# Altium project PCB_PlacaSensores.PrjPcb
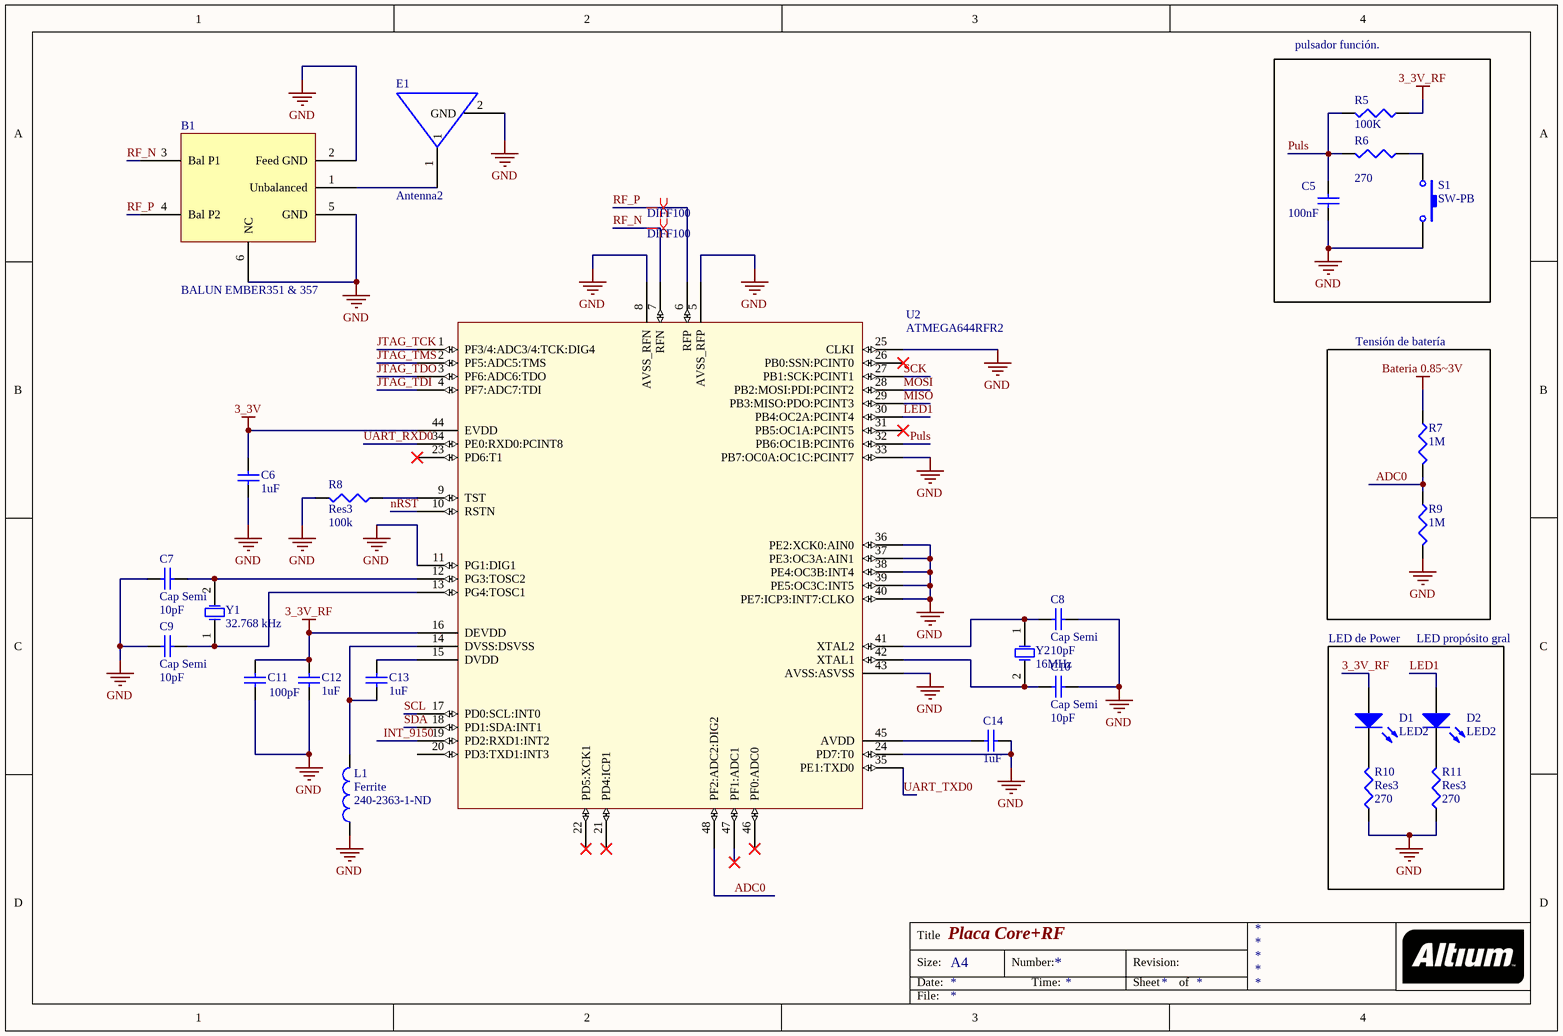
[diagram p0: CoreWB.SchDoc]
3 sheets, 50 parts. Net scope: global (net labels, ports and power ports of the same name join across sheets).
Board files: PCB_Wboard.PcbDoc, PCB1.PcbDoc
Sheets:
  CoreWB.SchDoc
  PowerWB2.SchDoc
  ConnWB.SchDoc

## Sheet CoreWB.SchDoc: Placa Core+RF
size A4; Author: Grupo 5 - Proyecto Final; DrawnBy: Bruno Valinoti; ProjectName: Controlador de luces MIDI

### Parts
(Parts that share a designator on the sheet are numbered #1, #2 ... from top to bottom, then left to right.)
B1  BALUN EMBER351 & 357  [Balun]
C5  value 100nF  [C1206]  (hidden comment: Cap Semi)
C6  value 1uF  [C1206]  (hidden comment: Cap Semi)
C7  Cap Semi  value 10pF  [1608[0603]]
C8  Cap Semi  value 10pF  [1608[0603]]
C9  Cap Semi  value 10pF  [1608[0603]]
C10  Cap Semi  value 10pF  [1608[0603]]
C11  value 100pF  [1608[0603]]  (hidden comment: Cap Semi)
C12  value 1uF  [C1206]  (hidden comment: Cap Semi)
C13  value 1uF  [C1206]  (hidden comment: Cap Semi)
C14  value 1uF  [C1206]  (hidden comment: Cap Semi)
D1  LED2  [3.2X1.6X1.1]
D2  LED2  [3.2X1.6X1.1]
E1  Antenna2  [ANTENNA]
L1  Ferrite  value 240-2363-1-ND  [0402-A]
R5  value 100K  [6-0805_M]  (hidden comment: Res3)
R6  value 270  [6-0805_M]  (hidden comment: Res3)
R7  value 1M  [6-0805_M]  (hidden comment: Res3)
R8  Res3  value 100k  [J1-0603]
R9  value 1M  [6-0805_M]  (hidden comment: Res3)
R10  Res3  value 270  [J1-0603]
R11#1  Res3  value 270  [J1-0603]
S1  SW-PB  [DPST-4]
U2  ATMEGA644RFR2  [Quad48]
Y1  32.768 kHz  [R38]
Y2  16MHz  [XTAL]

### Blocks framed on the sheet
pulsador función.: C5 R5 R6 S1

### Nets
3_3V: C6.1 U2.44(EVDD)
3_3V_RF: C11.2 C12.1 D1.1(A) R5.1 U2.16(DEVDD)
Bateria 0.85~3V: R7.1
GND: B1.2(Feed_GND) B1.5(GND) B1.6(NC) C5.2 C6.2 C7.1 C8.1 C9.1 C10.1 C11.1 C12.2 C14.2 E1.2(GND) L1.1 R8.2 R9.2 R10.1 R11#1.1 S1.2 U2.5(AVSS_RFP) U2.8(AVSS_RFN) U2.11(PG1:DIG1) U2.24(PD7:T0) U2.25(CLKI) U2.33(PB7:OC0A:OC1C:PCINT7) U2.36(PE2:XCK0:AIN0) U2.37(PE3:OC3A:AIN1) U2.38(PE4:OC3B:INT4) U2.39(PE5:OC3C:INT5) U2.40(PE7:ICP3:INT7:CLKO) U2.43(AVSS:ASVSS)
ADC0: R7.2 R9.1 U2.48(PF2:ADC2:DIG2)
INT_9150: U2.19(PD2:RXD1:INT2)
JTAG_TCK: U2.1(PF3/4:ADC3/4:TCK:DIG4)
JTAG_TDI: U2.4(PF7:ADC7:TDI)
JTAG_TDO: U2.3(PF6:ADC6:TDO)
JTAG_TMS: U2.2(PF5:ADC5:TMS)
LED1: D2.1(A) U2.30(PB4:OC2A:PCINT4)
MISO: U2.29(PB3:MISO:PDO:PCINT3)
MOSI: U2.28(PB2:MOSI:PDI:PCINT2)
nRST: U2.10(RSTN)
Puls: C5.1 R5.2 R6.2 U2.32(PB6:OC1B:PCINT6)
RF_N: B1.3(Bal_P1) U2.7(RFN)
RF_P: B1.4(Bal_P2) U2.6(RFP)
SCK: U2.27(PB1:SCK:PCINT1)
SCL: U2.17(PD0:SCL:INT0)
SDA: U2.18(PD1:SDA:INT1)
UART_RXD0: U2.34(PE0:RXD0:PCINT8)
UART_TXD0: U2.35(PE1:TXD0)
NetB1_1: B1.1(Unbalanced) E1.1
NetC7_2: C7.2 U2.12(PG3:TOSC2) Y1.2(OSC2)
NetC8_2: C8.2 U2.41(XTAL2) Y2.1(OSC1)
NetC9_2: C9.2 U2.13(PG4:TOSC1) Y1.1(OSC1)
NetC10_2: C10.2 U2.42(XTAL1) Y2.2(OSC2)
NetC13_1: C13.1 U2.15(DVDD)
NetC13_2: C13.2 L1.2 U2.14(DVSS:DSVSS)
NetC14_1: C14.1 U2.45(AVDD)
NetD1_2: D1.2(K) R10.2
NetD2_2: D2.2(K) R11#1.2
NetR6_1: R6.1 S1.1
NetR8_1: R8.1 U2.9(TST)

Not connected (* = marked no-connect by the designer): U2 20(PD3:TXD1:INT3) 21(PD4:ICP1)* 22(PD5:XCK1)* 23(PD6:T1)* 26(PB0:SSN:PCINT0)* 31(PB5:OC1A:PCINT5)* 46(PF0:ADC0)* 47(PF1:ADC1)*

### Layout directives
differential pair; class: DIFF100: RF_N, RF_P

### Notes on the sheet
- Tensión de batería
- LED de Power
- LED propósito gral
- Title
- Size:
- Date:
- A4
- Number:
- Time:
- Revision:
- Sheet
- of
- File:

### Library data of the parts
C5-C14 = Cap Semi: Capacitor (Semiconductor SIM Model); Published: 8-Jun-2000; LatestRevisionDate: 29-May-2009; LatestRevisionNote: IPC-7351 Footprint Added.; PackageReference: C1206; Publisher: Altium Limited; PackageDescription: Chip Capacitor
D1 D2 = LED2: Typical RED, GREEN, YELLOW, AMBER GaAs LED; Published: 8-Jun-2000; LatestRevisionDate: 17-Jul-2002; LatestRevisionNote: Re-released for DXP Platform.; PackageVersion: Feb-2002; PackageReference: 3.2X1.6X1.1; Publisher: Altium Limited; PackageDescription: SM LED; 2 Flat Leads
E1 = AntennaF: Antenna 2.4GHz
L1 = Inductor: Code_IEC: 1005; Published: 8-Jun-2000; LatestRevisionDate: 29-May-2009; LatestRevisionNote: IPC-7351 Footprint Added.; PackageReference: 0402-A; Publisher: Altium Limited; PackageDescription: Chip Inductor; Code_JEITA: 0402
R5-R10 R11#1 = Res3: Resistor; Published: 8-Jun-2000; LatestRevisionDate: 29-May-2009; LatestRevisionNote: IPC-7351 Footprint Added.; PackageReference: J1-0603; Publisher: Altium Limited; PackageDescription: Chip Resistor
S1 = SW-PB: Switch; Published: 24-Mar-1999; LatestRevisionDate: 17-Jul-2002; LatestRevisionNote: Re-released for DXP Platform.; PackageReference: SPST-2; Publisher: Altium Limited; PackageDescription: Switch; 2 Leads
Y1 Y2 = XTAL: Crystal Oscillator; Published: 8-Jun-2000; LatestRevisionDate: 17-Jul-2002; LatestRevisionNote: Re-released for DXP Platform.; PackageReference: R38; Publisher: Altium Limited; PackageDescription: Crystal, Thru-Hole; 2 Leads; Body 3.1 x 8.2 mm (Dia.xH)

## Sheet PowerWB2.SchDoc: Fuente de alimentación
size A4; Author: Grupo 5; DrawnBy: Bruno Valinoti; SheetNumber: 1
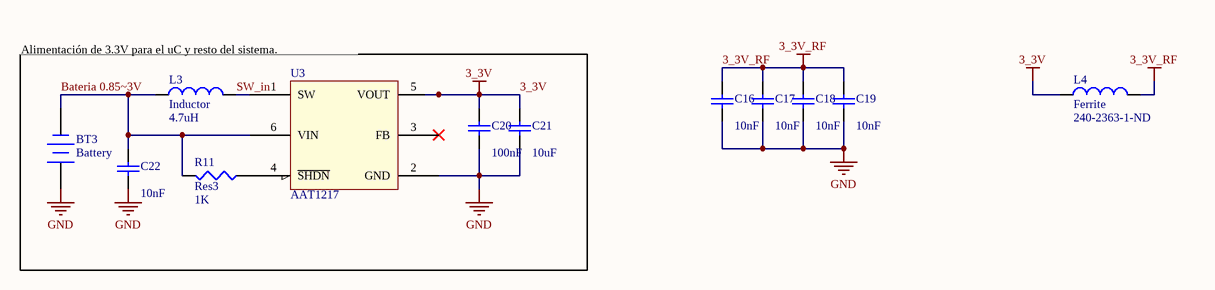
[diagram p1: PowerWB2.SchDoc]

### Parts
(Parts that share a designator on the sheet are numbered #1, #2 ... from top to bottom, then left to right.)
BT3  Battery  [BAT-2]
C16  value 10nF  [1608[0603]]  (hidden comment: Cap Semi)
C17  value 10nF  [1608[0603]]  (hidden comment: Cap Semi)
C18  value 10nF  [1608[0603]]  (hidden comment: Cap Semi)
C19  value 10nF  [1608[0603]]  (hidden comment: Cap Semi)
C20  value 100nF  [1608[0603]]  (hidden comment: Cap Semi)
C21  value 10uF  [1608[0603]]  (hidden comment: Cap Semi)
C22  value 10nF  [1608[0603]]  (hidden comment: Cap Semi)
L3  Inductor  value 4.7uH  [0402-A]
L4  Ferrite  value 240-2363-1-ND  [0402-A]
R11#2  Res3  value 1K  [6-0805_M]
U3  AAT1217  [SOT26A-6N]

### Nets
3_3V: C20.2 C21.2 L4.1 U3.5(VOUT)
3_3V_RF: C16.2 C17.2 C18.2 C19.2 L4.2
Bateria 0.85~3V: BT3.2(-) C22.2 L3.1 R11#2.2 U3.6(VIN)
GND: BT3.1(+) C16.1 C17.1 C18.1 C19.1 C20.1 C21.1 C22.1 U3.2(GND)
SW_in: L3.2 U3.1(SW)
NetR11#2_1: R11#2.1 U3.4(~{SHDN})

Not connected (* = marked no-connect by the designer): U3 3(FB)*

### Notes on the sheet
- Alimentación de 3.3V para el uC y resto del sistema.
- Title
- Size:
- Date:
- A4
- Number:
- Time:
- Revision:
- Sheet
- of
- File:

### Library data of the parts
BT3 = Battery: Multicell Battery; Published: 24-Mar-1999; LatestRevisionDate: 17-Jul-2002; LatestRevisionNote: Re-released for DXP Platform.; PackageReference: BAT-2; Publisher: Altium Limited; PackageDescription: Battery; 2 Leads
C16-C22 = Cap Semi: Capacitor (Semiconductor SIM Model); Published: 8-Jun-2000; LatestRevisionDate: 29-May-2009; LatestRevisionNote: IPC-7351 Footprint Added.; PackageReference: C1206; Publisher: Altium Limited; PackageDescription: Chip Capacitor
L3 L4 = Inductor: Code_IEC: 1005; Published: 8-Jun-2000; LatestRevisionDate: 29-May-2009; LatestRevisionNote: IPC-7351 Footprint Added.; PackageReference: 0402-A; Publisher: Altium Limited; PackageDescription: Chip Inductor; Code_JEITA: 0402
R11#2 = Res3: Resistor; Published: 8-Jun-2000; LatestRevisionDate: 29-May-2009; LatestRevisionNote: IPC-7351 Footprint Added.; PackageReference: J1-0603; Publisher: Altium Limited; PackageDescription: Chip Resistor

## Sheet ConnWB.SchDoc: ConectoresWB-MPU9150
size A4
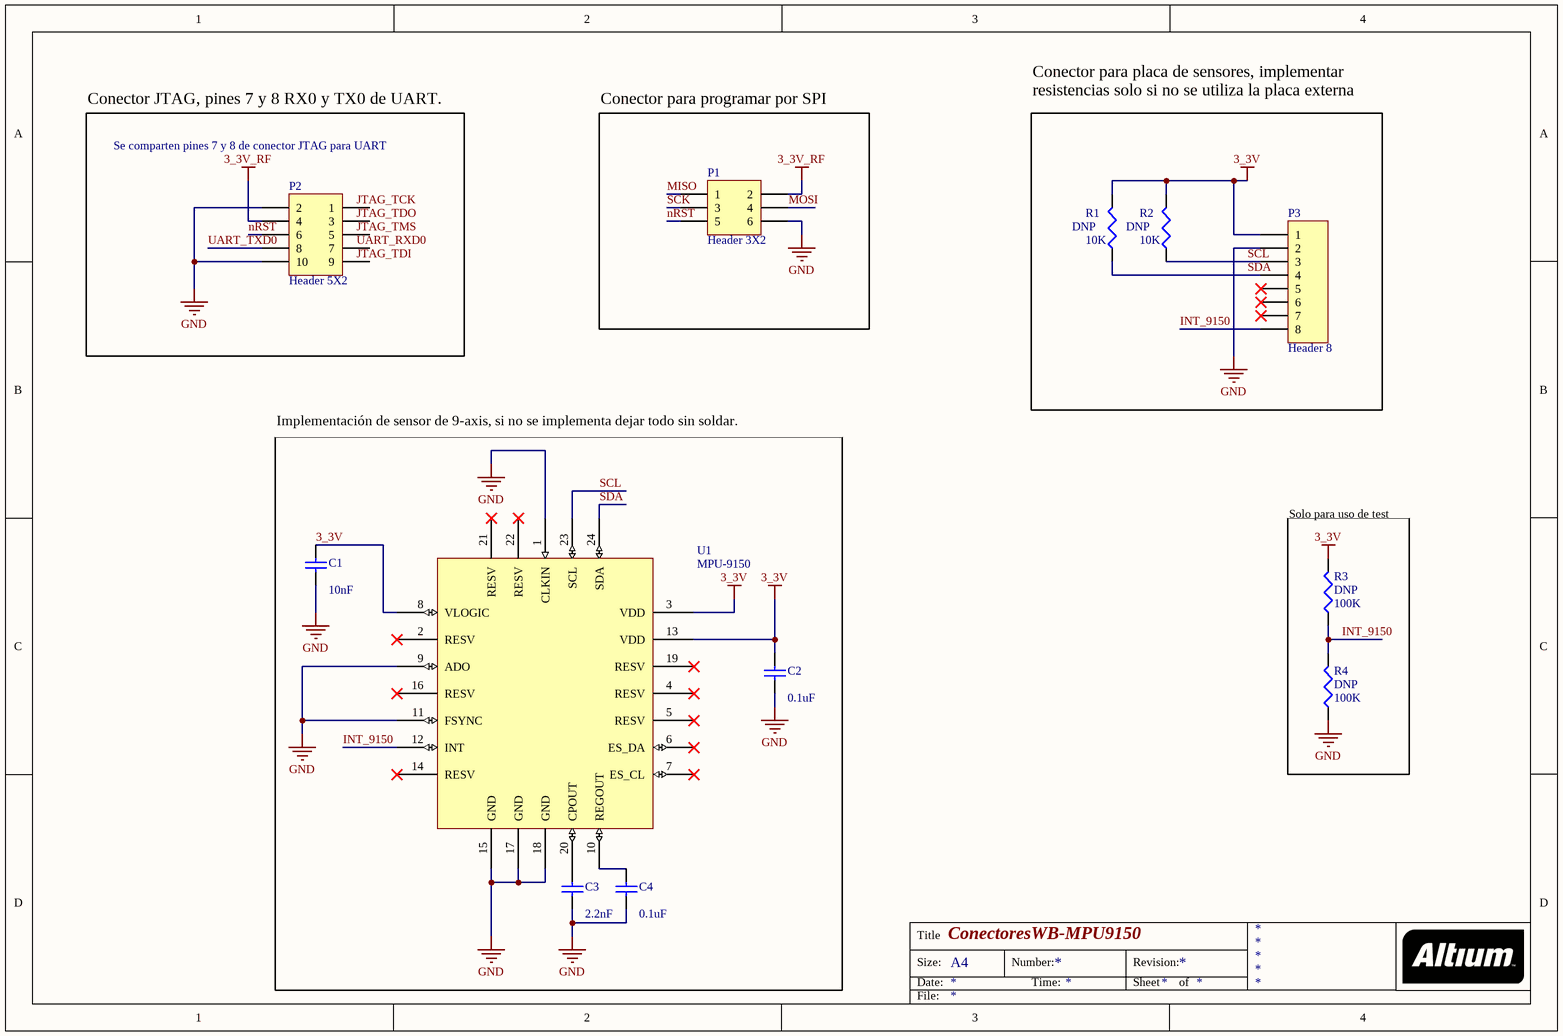
[diagram p2: ConnWB.SchDoc]

### Parts
C1  value 10nF  [1608[0603]]  (hidden comment: Cap Semi)
C2  value 0.1uF  [C1206]  (hidden comment: Cap Semi)
C3  value 2.2nF  [1608[0603]]  (hidden comment: Cap Semi)
C4  value 0.1uF  [1608[0603]]  (hidden comment: Cap Semi)
P1  Header 3X2  [HDR2X3]
P2  Header 5X2  [HDR2X5]
P3  Header 8  [Conector8]
R1  DNP  value 10K  [6-0805_M]
R2  DNP  value 10K  [6-0805_M]
R3  DNP  value 100K  [6-0805_M]
R4  DNP  value 100K  [6-0805_M]
U1  MPU-9150  [QFP-24]

### Blocks framed on the sheet
Se comparten pines 7 y 8 de conector JTAG para UART: P2

### Nets
3_3V: C1.2 C2.1 P3.1 R1.2 R2.2 R3.2 U1.3(VDD) U1.8(VLOGIC) U1.13(VDD)
3_3V_RF: P1.2 P2.4
GND: C1.1 C2.2 C3.1 C4.1 P1.6 P2.2 P2.10 P3.2 R4.1 U1.1(CLKIN) U1.9(ADO) U1.11(FSYNC) U1.15(GND) U1.17(GND) U1.18(GND)
INT_9150: P3.8 R3.1 R4.2 U1.12(INT)
MISO: P1.1
MOSI: P1.4
nRST: P1.5 P2.6
SCK: P1.3
SCL: P3.3 R2.1 U1.23(SCL)
SDA: P3.4 R1.1 U1.24(SDA)
UART_TXD0: P2.8
NetC3_2: C3.2 U1.20(CPOUT)
NetC4_2: C4.2 U1.10(REGOUT)

Not connected (* = marked no-connect by the designer): P2 1 3 5 7 9; P3 5* 6* 7*; U1 2(RESV)* 4(RESV)* 5(RESV)* 6(ES_DA)* 7(ES_CL)* 14(RESV)* 16(RESV)* 19(RESV)* 21(RESV)* 22(RESV)*

### Notes on the sheet
- Conector JTAG, pines 7 y 8 RX0 y TX0 de UART.
- Conector para programar por SPI
- Conector para placa de sensores, implementar
  resistencias solo si no se utiliza la placa externa
- Implementación de sensor de 9-axis, si no se implementa dejar todo sin soldar.
- Solo para uso de test
- Labels drawn without touching a wire or pin: JTAG_TCK, JTAG_TDI, JTAG_TDO, JTAG_TMS, UART_RXD0
- Title
- Size:
- Date:
- A4
- Number:
- Time:
- Revision:
- Sheet
- of
- File:

### Library data of the parts
C1-C4 = Cap Semi: Capacitor (Semiconductor SIM Model); Published: 8-Jun-2000; LatestRevisionDate: 29-May-2009; LatestRevisionNote: IPC-7351 Footprint Added.; PackageReference: C1206; Publisher: Altium Limited; PackageDescription: Chip Capacitor
P1 = Header 3X2: Header, 3-Pin, Dual row; LatestRevisionDate: 17-Jul-2002; LatestRevisionNote: Re-released for DXP Platform.; Publisher: Altium Limited
P2 = Header 5X2: Header, 5-Pin, Dual row; LatestRevisionDate: 17-Jul-2002; LatestRevisionNote: Re-released for DXP Platform.; Publisher: Altium Limited
P3 = Header 8: Header, 8-Pin; LatestRevisionDate: 17-Jul-2002; LatestRevisionNote: Re-released for DXP Platform.; Publisher: Altium Limited
R1-R4 = Res3: Resistor; Published: 8-Jun-2000; LatestRevisionDate: 29-May-2009; LatestRevisionNote: IPC-7351 Footprint Added.; PackageReference: J1-0603; Publisher: Altium Limited; PackageDescription: Chip Resistor
U1 = MPU-9150: Integrated 9-axis MotionTracking device

## Nets that join several sheets
3_3V: CoreWB (C6.1 U2.44), PowerWB2 (C20.2 C21.2 L4.1 U3.5), ConnWB (9 pins)
3_3V_RF: CoreWB (5 pins), PowerWB2 (5 pins), ConnWB (P1.2 P2.4)
Bateria 0.85~3V: CoreWB (R7.1), PowerWB2 (5 pins)
GND: CoreWB (31 pins), PowerWB2 (9 pins), ConnWB (15 pins)
INT_9150: CoreWB (U2.19), ConnWB (P3.8 R3.1 R4.2 U1.12)
MISO: CoreWB (U2.29), ConnWB (P1.1)
MOSI: CoreWB (U2.28), ConnWB (P1.4)
nRST: CoreWB (U2.10), ConnWB (P1.5 P2.6)
SCK: CoreWB (U2.27), ConnWB (P1.3)
SCL: CoreWB (U2.17), ConnWB (P3.3 R2.1 U1.23)
SDA: CoreWB (U2.18), ConnWB (P3.4 R1.1 U1.24)
UART_TXD0: CoreWB (U2.35), ConnWB (P2.8)